# Altium schematic sheet schematic.SchDoc: <Project Name>
size A4; ENG_APP_DATE: --/--/--; DSN_APP_DATE: --/--/--; CHK_APP_DATE: --/--/--; Engineer: Engineer; Address4: Thành phố Hồ Chí Minh; DocumentNumber: 1; Revision: 1.0; SheetNumber: 1; SheetTotal: 1
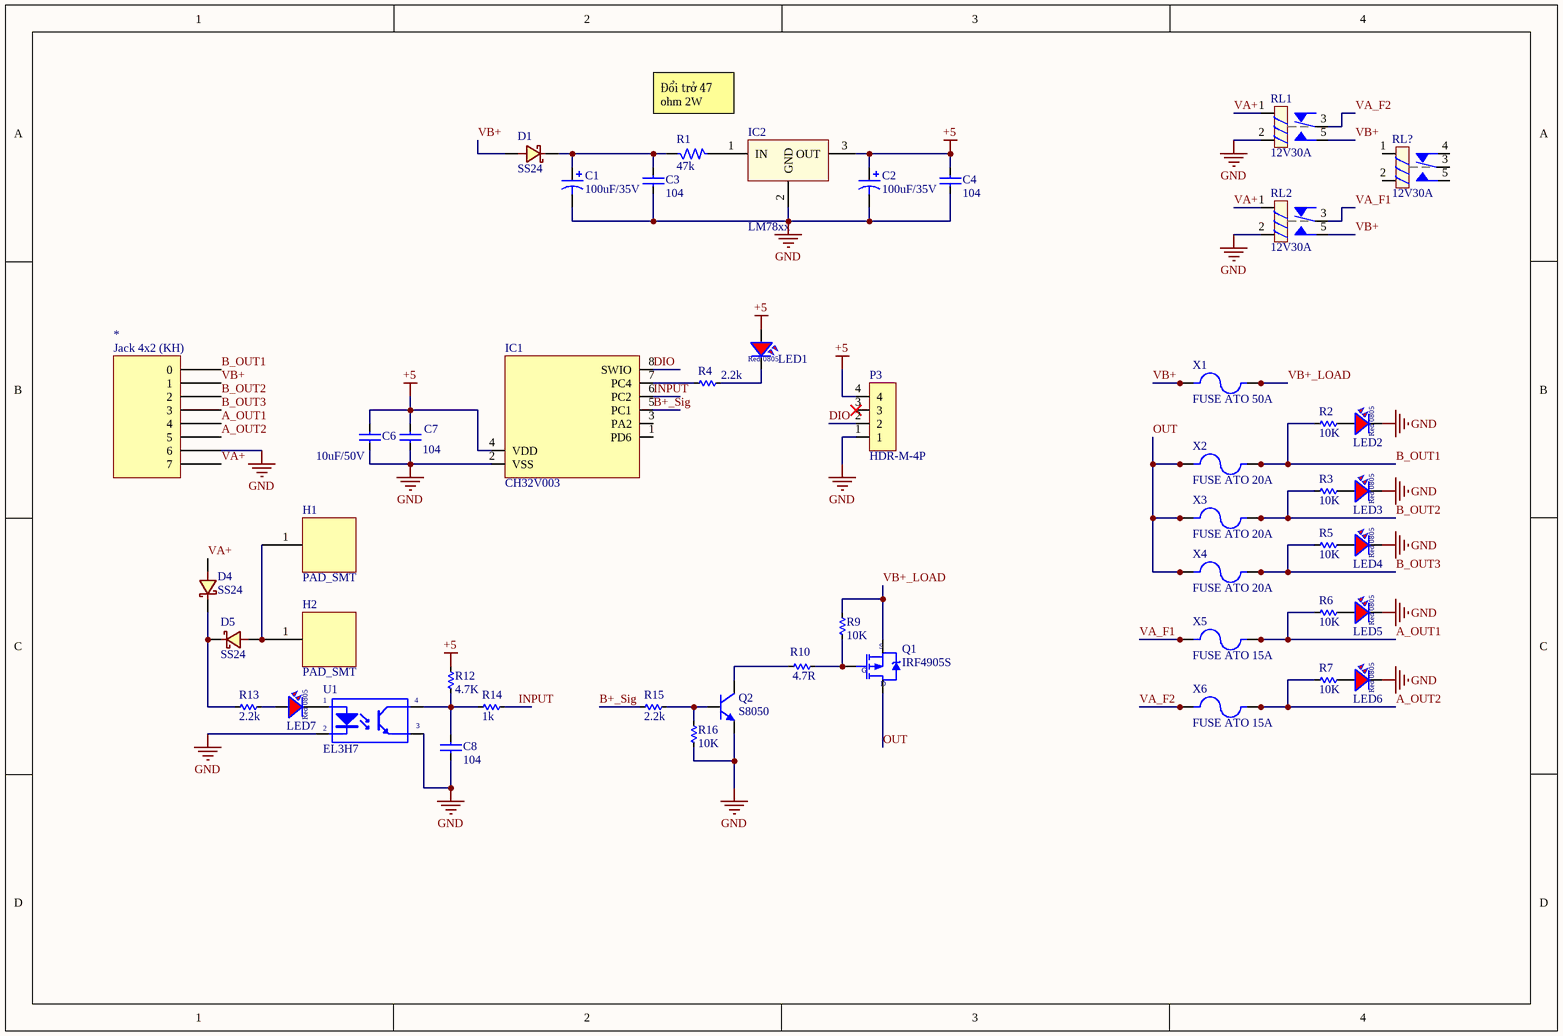
[diagram p0: schematic.SchDoc]

## Parts
*  x  [Jack 4x2 (KH)]  (value not drawn)
C1  100uF/35V  [C_6.3x12]
C2  100uF/35V  [C_6.3x12]
C3  104  [C_0805_SMD]
C4  104  [C_0805_SMD]
C6  10uF/50V  [C_0805_SMD]
C7  104  [C_0805_SMD]
C8  104  [C_0805_SMD]
D1  SS24  [D_SMA]
D4  SS24  [D_SMA]
D5  SS24  [D_SMA]
H1  PAD_SMT  [PAD_CELL_3X6]
H2  PAD_SMT  [PAD_CELL_3X6]
IC1  CH32V003  [SO_8]
IC2  LM78xx  [QTO-220]
LED1  LED RED  [LED 0805 Red]  (value not drawn)  (no BOM)
LED2  LED RED  [LED 0805 Red]  (value not drawn)
LED3  LED RED  [LED 0805 Red]  (value not drawn)
LED4  LED RED  [LED 0805 Red]  (value not drawn)
LED5  LED RED  [LED 0805 Red]  (value not drawn)
LED6  LED RED  [LED 0805 Red]  (value not drawn)
LED7  LED RED  [LED 0805 Red]  (value not drawn)
P3  HDR-M-4P  [HDR_M_1X4]  (no BOM)
Q1  IRF4905S  [TO-263]
Q2  S8050  [SOT23_N NXP]
R1  47k  [RES_2W]
R2  10K  [RES-SMD-0805]
R3  10K  [RES-SMD-0805]
R4  2.2k  [RES-SMD-0805]  (no BOM)
R5  10K  [RES-SMD-0805]
R6  10K  [RES-SMD-0805]
R7  10K  [RES-SMD-0805]
R9  10K  [RES-SMD-0805]
R10  4.7R  [RES-SMD-0805]
R12  4.7K  [RES-SMD-0805]
R13  2.2k  [RES-SMD-0805]
R14  1k  [RES-SMD-0805]
R15  2.2k  [RES-SMD-0805]
R16  10K  [RES-SMD-0805]
RL1  12V30A  [Relay 30A 5 Pin]
RL2  12V30A  [Relay 30A 5 Pin]
RL?  12V30A  [RELAY-30A-6PIN]
U1  EL3H7  [SO_4-EL3H7-G_MFG]
X1  FUSE ATO 50A  [Fuse ATO]
X2  FUSE ATO 20A  [Fuse ATO]
X3  FUSE ATO 20A  [Fuse ATO]
X4  FUSE ATO 20A  [Fuse ATO]
X5  FUSE ATO 15A  [Fuse ATO]
X6  FUSE ATO 15A  [Fuse ATO]

## Nets
+5: C2.1 C4.2 C6.2 C7.2 IC1.4(VDD) IC2.3(OUT) LED1.1 P3.4 R12.1
GND: *.6 C1.2 C2.2 C3.1 C4.1 C6.1 C7.1 C8.1 IC1.2(VSS) IC2.2(GND) LED2.2 LED3.2 LED4.2 LED5.2 LED6.2 P3.1 Q2.2(E) R16.2 RL1.2 RL2.2 U1.2(K) U1.3(E)
A_OUT1: *.4 R6.2 X5.2A X5.2B
A_OUT2: *.5 R7.2 X6.2A X6.2B
B+_Sig: IC1.5(PC1) R15.2
B_OUT1: *.0 R2.2 X2.2A X2.2B
B_OUT2: *.2 R3.2 X3.2A X3.2B
B_OUT3: *.3 R5.2 X4.2A X4.2B
DIO: IC1.8(SWIO) P3.2
INPUT: IC1.6(PC2) R14.1
OUT: Q1.2(D) X2.1A X2.1B X3.1A X3.1B X4.1A X4.1B
VA+: *.7 D4.1(A) RL1.1 RL2.1
VA_F1: RL2.3 X5.1A X5.1B
VA_F2: RL1.3 X6.1A X6.1B
VB+: *.1 D1.1(A) RL1.5 RL2.5 X1.1A X1.1B
VB+_LOAD: Q1.3(S) R9.1 X1.2A X1.2B
NetC1_1: C1.1 C3.2 D1.2(K) R1.1
NetC8_2: C8.2 R12.2 R14.2 U1.4(C)
NetD4_2: D4.2(K) D5.2(K) R13.2
NetD5_1: D5.1(A) H1.1 H2.1
NetIC1_7: IC1.7(PC4) R4.2
NetIC2_1: IC2.1(IN) R1.2
NetLED1_2: LED1.2 R4.1
NetLED2_1: LED2.1 R2.1
NetLED3_1: LED3.1 R3.1
NetLED4_1: LED4.1 R5.1
NetLED5_1: LED5.1 R6.1
NetLED6_1: LED6.1 R7.1
NetLED7_1: LED7.1 R13.1
NetLED7_2: LED7.2 U1.1(A)
NetQ1_1: Q1.1(G) R9.2 R10.1
NetQ2_1: Q2.1(B) R15.1 R16.1
NetQ2_3: Q2.3(C) R10.2

Not connected (* = marked no-connect by the designer): IC1 1(PD6) 3(PA2); P3 3*; RL? 1 2 3 4 5

## Notes on the sheet
- Đổi trở 47 ohm 2W
- Title
- Size:
- Date:
- A4
- Number:
- Time:
- Revision:
- Sheet
- of
- File:
- (in symbol Jack 4x2 250x410mm (KH)) Jack 4x2 (KH)
- (in symbol LED 0805 RED) Red; 0805

## Library data of the parts
* = Jack 4x2 250x410mm (KH)
C1 C2 = Cap Pol 100uF/35V: Polarized Capacitor (Axial) 100uF 35V; Code: 1402-225
C3 C4 C7 C8 = Cap 0805 104 100nF: Cap SMD 0805 104-100nF-0.1uF 50V; Code: 1438-080
C6 = Cap 0805 10uF 50V: Cap SMD 0805 10uF 50V; Code: 1438-100
D1 D4 D5 = SS24-SMA: Diode Schottky 2A SS24 DO-241; Code: 2005-023
H1 H2 = PAD_6x3x0_3: Code: N/A
IC1 = CH32V003J4M6: ROM 16KB, SRAM 2KB, 1920B BootLoader; Designed by: Nhox; Code: N/A
IC2 = LM7805 QTO-220: Code: 5102-037
LED1-LED7 = LED 0805 RED: LED 0805 SMD RED; Code: 8600-017; Designed by: TranLuyen
P3 = HDR 2.54 M 4 Pin: HDR 2.54 MALE; Code: 3504-028 * 0.1
Q1 = IRF4905S - TO-263: Trans MOSFET P-CH 55V 74A 3-Pin; Code: 1901-043
Q2 = S8050 SOT-23: J3Y-NPN SMD Transistor SOT23; Code: 1701-070
R1 = Res 2W 47K: Res 2W; Code: 1008-079
R2 R3 R5-R7 R9 R16 = Res 10k 0805: Resistor SMD 0805; Code: 1024-111
R4 R13 R15 = Res 2.2K 0805: Resistor SMD 0805; Code: 1024-094
R10 = Res 4.7R 0805: Resistor SMD 0805; Code: 1024-030
R12 = Res 4.7k 0805: Resistor SMD 0805; Code: 1024-103
R14 = Res 1k 0805: Resistor SMD 0805; Code: 1024-086
RL1 RL2 = Relay SLA-12VDC-SL-A-30A 5P: Code: 2403-209
RL? = Relay SLA-12VDC-SL-C-30A 6P: Code: 2403-023
U1 = EL3H7(C)(TA)-VG SSOP-4: Optocoupler DC-IN 1-CH Transistor DC-OUT 4-Pin SSOP T/R; Code: 2303-012; Designed by: TranLuyen; ComponentLink1Description: Datasheet; ComponentLink1URL: https://datasheet.octopart.com/EL3H7%28C%29%28TA%29-VG-Everlight-datasheet-101745741.pdf
X1-X6 = FUSE ATO: MF: {'manufacturer': u'Keystone Electronics'}; MP: 3522-2; Availability: Unavailable; Price: None; Value: *; Package: None